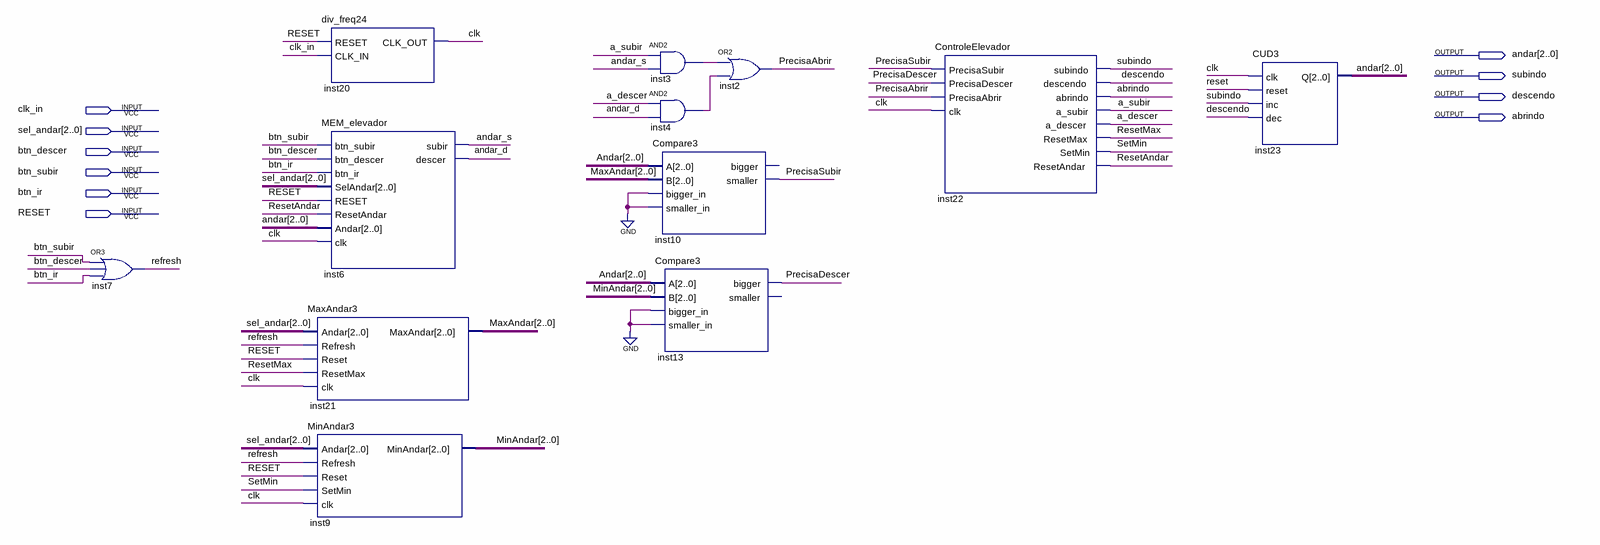
[diagram p0: schematic sheet]
// Quartus schematic Elevador.bdf as structural Verilog: 12 symbols, 10 pins
module Elevador (
  input  clk_in,
  input  [2:0] sel_andar,
  input  btn_descer,
  input  btn_subir,
  input  btn_ir,
  input  RESET,
  output [2:0] andar,
  output subindo,
  output descendo,
  output abrindo
);

  wire a_descer, a_subir, andar_d, andar_s, clk, inst3_out, inst4_out, PrecisaAbrir, PrecisaDescer,
       PrecisaSubir, refresh, ResetAndar, ResetMax, SetMin;
  wire [2:0] MaxAndar, MinAndar;

  or inst7 (refresh, btn_subir, btn_descer, btn_ir);
  MaxAndar3 inst21 (
    .Andar(sel_andar), .Refresh(refresh), .Reset(RESET), .ResetMax(ResetMax), .clk(clk), .MaxAndar(MaxAndar));
  MinAndar3 inst9 (
    .Andar(sel_andar), .Refresh(refresh), .Reset(RESET), .SetMin(SetMin), .clk(clk), .MinAndar(MinAndar));
  div_freq24 inst20 (.RESET(RESET), .CLK_IN(clk_in), .CLK_OUT(clk));
  MEM_elevador inst6 (
    .btn_subir(btn_subir), .btn_descer(btn_descer), .btn_ir(btn_ir), .SelAndar(sel_andar), .RESET(RESET),
    .ResetAndar(ResetAndar), .Andar(andar), .clk(clk), .subir(andar_s), .descer(andar_d));
  and inst3 (inst3_out, a_subir, andar_s);
  and inst4 (inst4_out, a_descer, andar_d);
  Compare3 inst10 (
    .A(andar), .B(MaxAndar), .bigger_in(1'b0), .smaller_in(1'b0), .smaller(PrecisaSubir));  // open: bigger
  Compare3 inst13 (
    .A(andar), .B(MinAndar), .bigger_in(1'b0), .smaller_in(1'b0), .bigger(PrecisaDescer));  // open: smaller
  or inst2 (PrecisaAbrir, inst3_out, inst4_out);
  ControleElevador inst22 (
    .PrecisaSubir(PrecisaSubir), .PrecisaDescer(PrecisaDescer), .PrecisaAbrir(PrecisaAbrir), .clk(clk),
    .subindo(subindo), .descendo(descendo), .abrindo(abrindo), .a_subir(a_subir), .a_descer(a_descer),
    .ResetMax(ResetMax), .SetMin(SetMin), .ResetAndar(ResetAndar));
  CUD3 inst23 (.clk(clk), .reset(RESET), .inc(subindo), .dec(descendo), .Q(andar));
endmodule
